# Altium schematic sheet Sheet2.SchDoc
size A; SheetNumber: 7; SheetTotal: 7
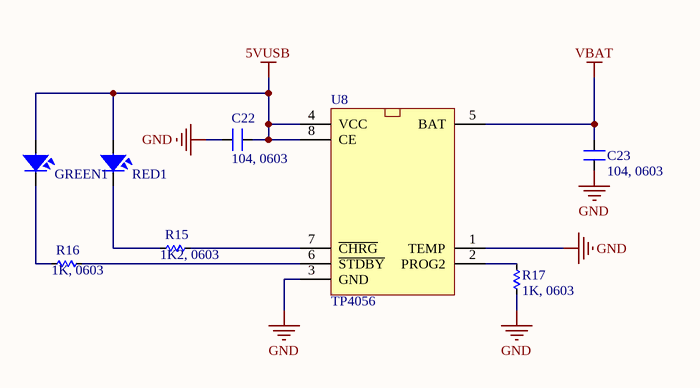
[diagram p0: Sheet2.SchDoc]

## Parts
C22  104, 0603  [SM-0603]
C23  104, 0603  [SM-0603]
GREEN1  LED  [LED-0805-Blue]  (value not drawn)
R15  1K2, 0603  [RES-SMD-0603]
R16  1K, 0603  [RES-SMD-0603]
R17  1K, 0603  [RES-SMD-0603]
RED1  LED  [LED-0805-Blue]  (value not drawn)
U8  TP4056  [SOP8_L]

## Nets
5VUSB: C22.1 GREEN1.1 RED1.1 U8.4(VCC) U8.8(CE)
GND: C22.2 C23.2 R17.2 U8.1(TEMP) U8.3(GND)
VBAT: C23.1 U8.5(BAT)
NetGREEN1_2: GREEN1.2 R16.2
NetR15_1: R15.1 U8.7(~{CHRG})
NetR15_2: R15.2 RED1.2
NetR16_1: R16.1 U8.6(~{STDBY})
NetR17_1: R17.1 U8.2(PROG2)

## Library data of the parts
C22 C23 = CM: Cap SMD; Value: 103
GREEN1 RED1 = LED SMD: Value: LED 3 - 5 ly 2 Colour
R15-R17 = Res-SMD: Resistor; Manufacturer: Generic Components; Class: Passive; Published: 08/06/2000; Publisher: Altium Hobart Technology Centre
U8 = TP4056: 1A Standalone Linear Li-lon Battery Charger with Thermal   Regulation